# EAGLE design 15V Regulated Dual Power Supply Circuit (EAGLE 9.6.2)
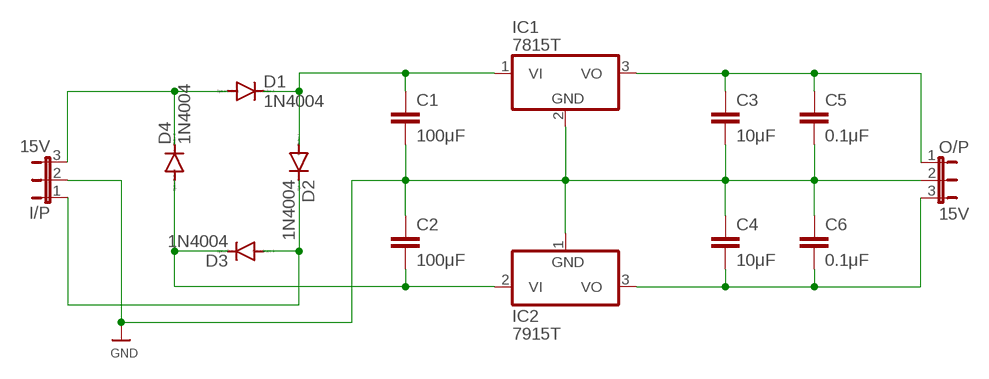
[diagram p0: schematic, sheet 1]

## Parts
C1  100μF  C2.5/2  [C2.5-2]
C2  100μF  C2.5/2  [C2.5-2]
C3  10μF  C2.5/2  [C2.5-2]
C4  10μF  C2.5/2  [C2.5-2]
C5  0.1μF  C2.5/2  [C2.5-2]
C6  0.1μF  C2.5/2  [C2.5-2]
D1  1N4004  [DO41-10]
D2  1N4004  [DO41-10]
D3  1N4004  [DO41-10]
D4  1N4004  [DO41-10]
I/P  15V  JP2E  [JP2]
IC1  7815T  [TO220H]
IC2  7915T  [TO220H]
O/P  15V  JP2E  [JP2]

## Nets
GND: C1.2 C2.1 C3.2 C4.1 C5.2 C6.1 I/P.2 IC1.2(GND) IC2.1(GND) O/P.2
N$1: D1.A D4.C I/P.3
N$2: C1.1 D1.C D2.A IC1.1(VI)
N$3: D2.C D3.A I/P.1
N$4: C2.2 D3.C D4.A IC2.2(VI)
N$8: C4.2 C6.2 IC2.3(VO) O/P.3
N$9: C3.1 C5.1 IC1.3(VO) O/P.1

## Library data of the parts
C1-C6 = capacitor-wima:C: CAPACITOR naming: grid - package width
D1-D4 = diode:1N4004: DIODE general purpose rectifier, 1 A
I/P O/P = jumper:JP2E: JUMPER
IC1 = linear:78*: Positive VOLTAGE REGULATOR Source: http://cache.national.com/ds/LM/LM78L05.pdf http://www.fairchildsemi.com/ds/LM/LM7805.pdf
IC2 = linear:79*: Negative VOLTAGE REGULATOR

## Board
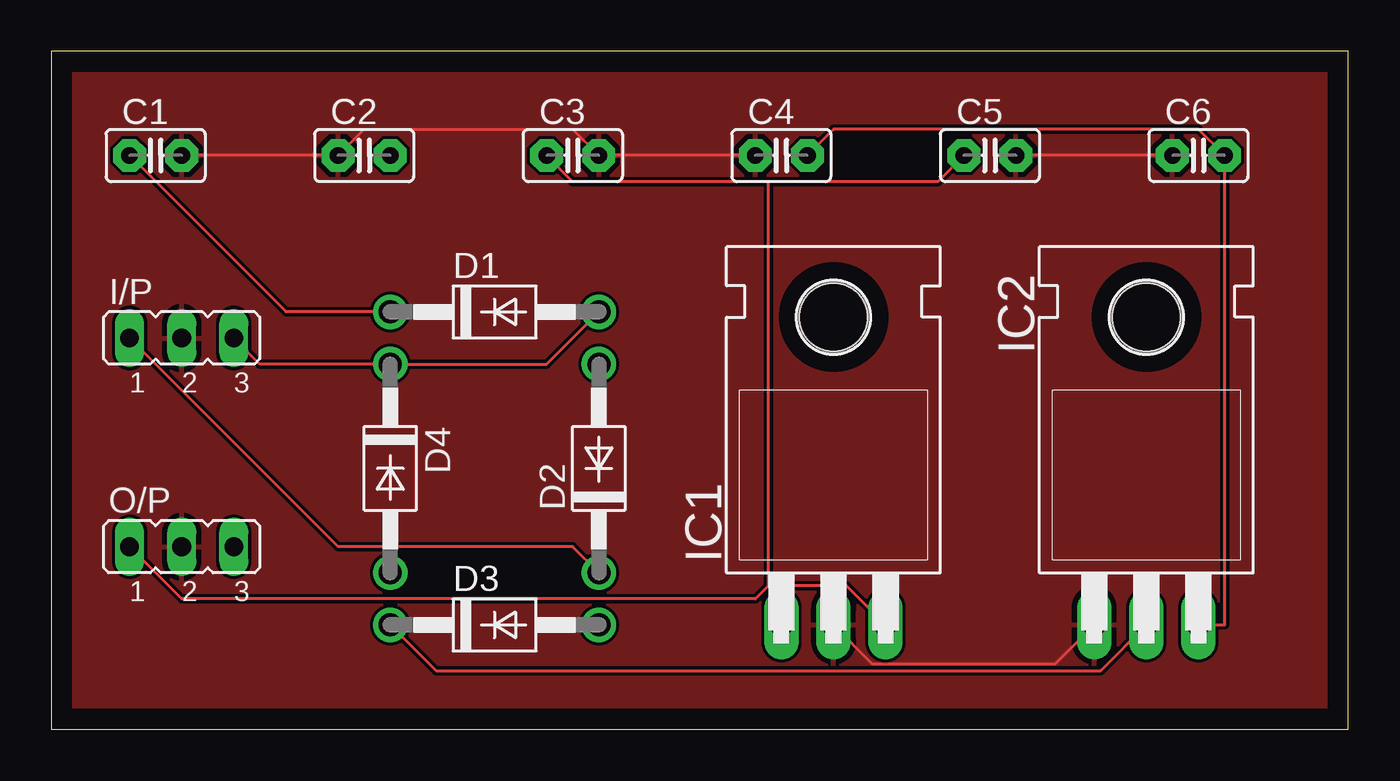
[diagram p1: board, top side]
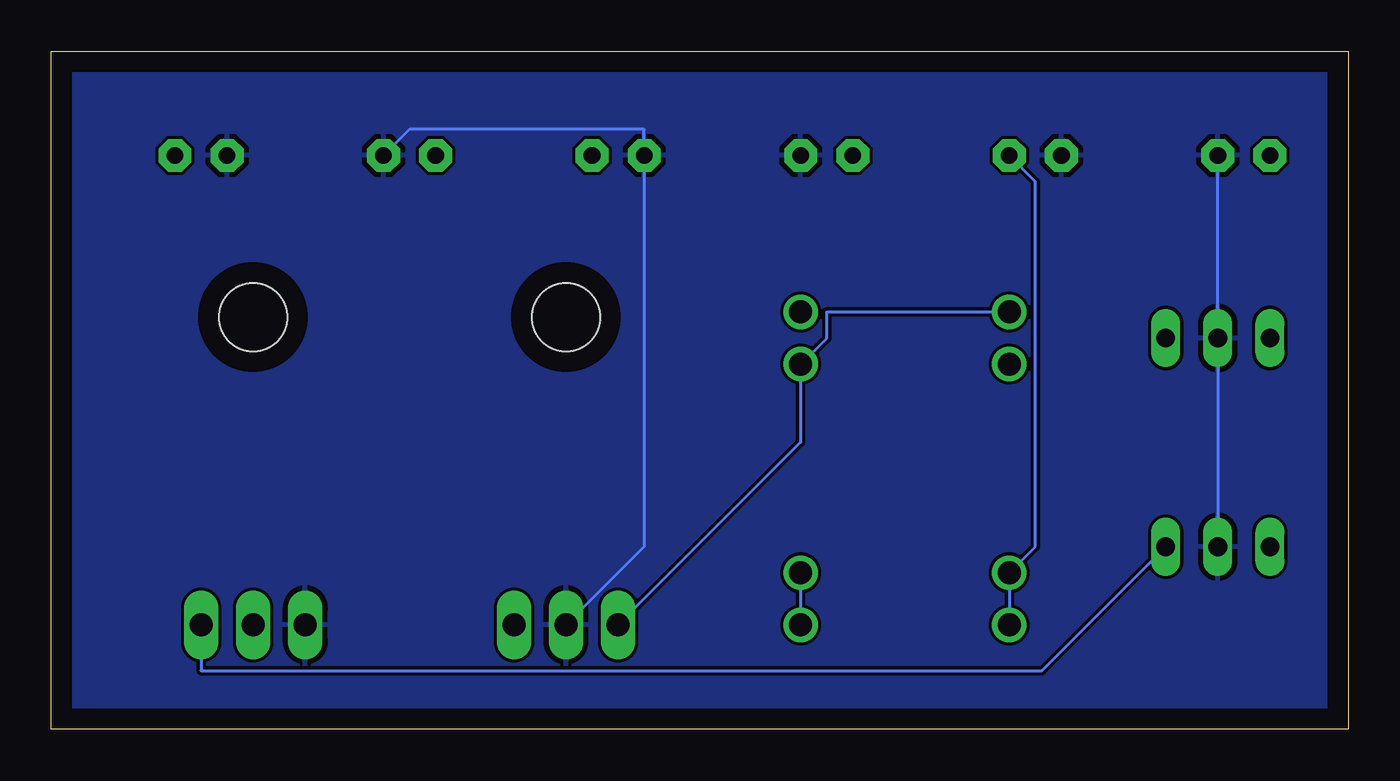
[diagram p2: board, bottom side, seen from below]

Size 63.17 x 33.01 mm. Coordinates in mm from the lower left corner, seen from the top.
Outline: 0,0 63.17,0 63.17,33.01 0,33.01 0,0
Copper layers (1*16): Top 0.035mm / dielectric 1.5mm / Bottom 0.035mm
Design rules "default": minimum track width 6mil, minimum drill 0.35mm, track to track 6mil, track to pad 6mil, pad to pad 6mil, via to via 6mil, smd to smd 6mil, copper to edge 40mil, drill to drill 6mil, minimum pad ring 10mil, minimum via ring 8mil, stop-mask expansion 4mil, vias tented up to drill 0mil, thermal gap 10mil

### Footprints (pad centres in the part's own frame; a part is rotated, then mirrored left to right if it is on the bottom)
C2.5-2 = drill 0.813 pad 1.6 octagon: 1 -1.27,0; 2 1.27,0
DO41-10 = drill 1.118: A 5.08,0; C -5.08,0
JP2 = drill 0.914 long: 1 -2.54,0; 2 0,0; 3 2.54,0
TO220H = drill 1.118 long: 1 -2.54,-10.16; 2 0,-10.16; 3 2.54,-10.16 | hole 3.302: 0,4.826

### Placement (x,y rotation side)
C1  5.08,27.94 0 top
C2  15.24,27.94 0 top
C3  25.4,27.94 0 top
C4  35.56,27.94 0 top
C5  45.72,27.94 0 top
C6  55.88,27.94 0 top
D1  21.59,20.32 0 top
D2  26.67,12.7 90 top
D3  21.59,5.08 0 top
D4  16.51,12.7 270 top
I/P  6.35,19.05 0 top
IC1  38.1,15.24 0 top
IC2  53.34,15.24 0 top
O/P  6.35,8.89 0 top

### Tracks (layer width: path | path; a pad name or v marks a point on that pad's centre or on a via)
GND
  Top 0.152: IC1.2 40,3.17 48.89,3.17 IC2.1 | C6.1 C5.2 | C4.1 C3.2 25.4,29.21 15.24,29.21 C2.1 C1.2
  Bottom 0.152: O/P.2 I/P.2 C1.2 | C5.2 45.72,29.21 34.29,29.21 C4.1 34.29,8.89 IC1.2
  pour Top: -1.27,34.29 64.77,34.29 64.77,33.02 64.77,-1.27 -1.27,-1.27
  pour Bottom: -2.54,35.56 66.04,35.56 66.04,-2.54 -2.54,-2.54
N$1
  Top 0.152: I/P.3 10.16,17.78 D4.C 24.13,17.78 D1.A
N$2
  Top 0.152: C1.1 11.43,20.32 D1.C
  Bottom 0.152: IC1.1 26.67,13.97 D2.A 25.4,19.05 25.4,20.32 D1.C
N$3
  Top 0.152: I/P.1 13.97,8.89 25.4,8.89 D2.C
  Bottom 0.152: D2.C D3.A
N$4
  Top 0.152: IC2.2 51.12,2.86 18.73,2.86 D3.C
  Bottom 0.152: C2.2 15.24,26.67 15.24,8.89 D4.A D3.C
N$8
  Top 0.152: C4.2 38.1,29.21 55.88,29.21 C6.2 57.15,5.08 IC2.3
  Bottom 0.152: O/P.3 14.92,2.86 55.88,2.86 IC2.3
N$9
  Top 0.152: C3.1 25.4,26.67 34.92,26.67 | 34.92,26.67 43.18,26.67 C5.1 | O/P.1 6.35,6.35 34.29,6.35 34.92,6.99 | 34.92,6.99 38.73,6.99 IC1.3 | 34.92,6.99 34.92,26.67

### Text on the board
tValues: 64 | VM